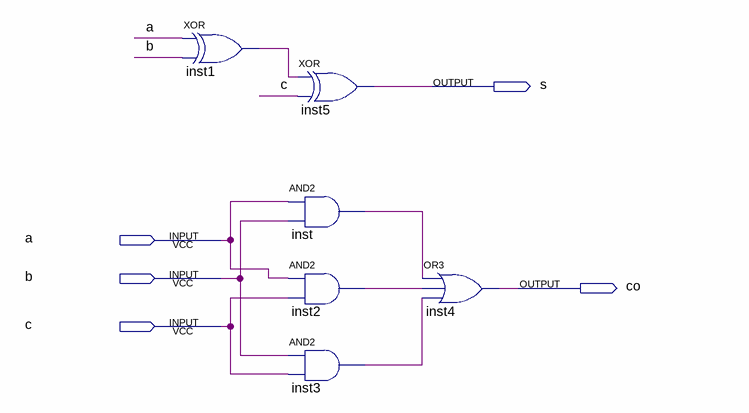
[diagram p0: schematic sheet]
// Quartus schematic Pratica01_02.bdf as structural Verilog: 6 symbols, 5 pins
module Pratica01_02 (
  input  a,
  input  b,
  input  c,
  output s,
  output co
);

  wire inst1_out, inst2_out, inst3_out, inst_out;

  xor inst1 (inst1_out, a, b);
  xor inst5 (s, inst1_out, c);
  and inst (inst_out, a, b);
  and inst2 (inst2_out, a, c);
  and inst3 (inst3_out, b, c);
  or inst4 (co, inst_out, inst2_out, inst3_out);
endmodule
